# EAGLE design attiny85 (EAGLE 7.7.0)
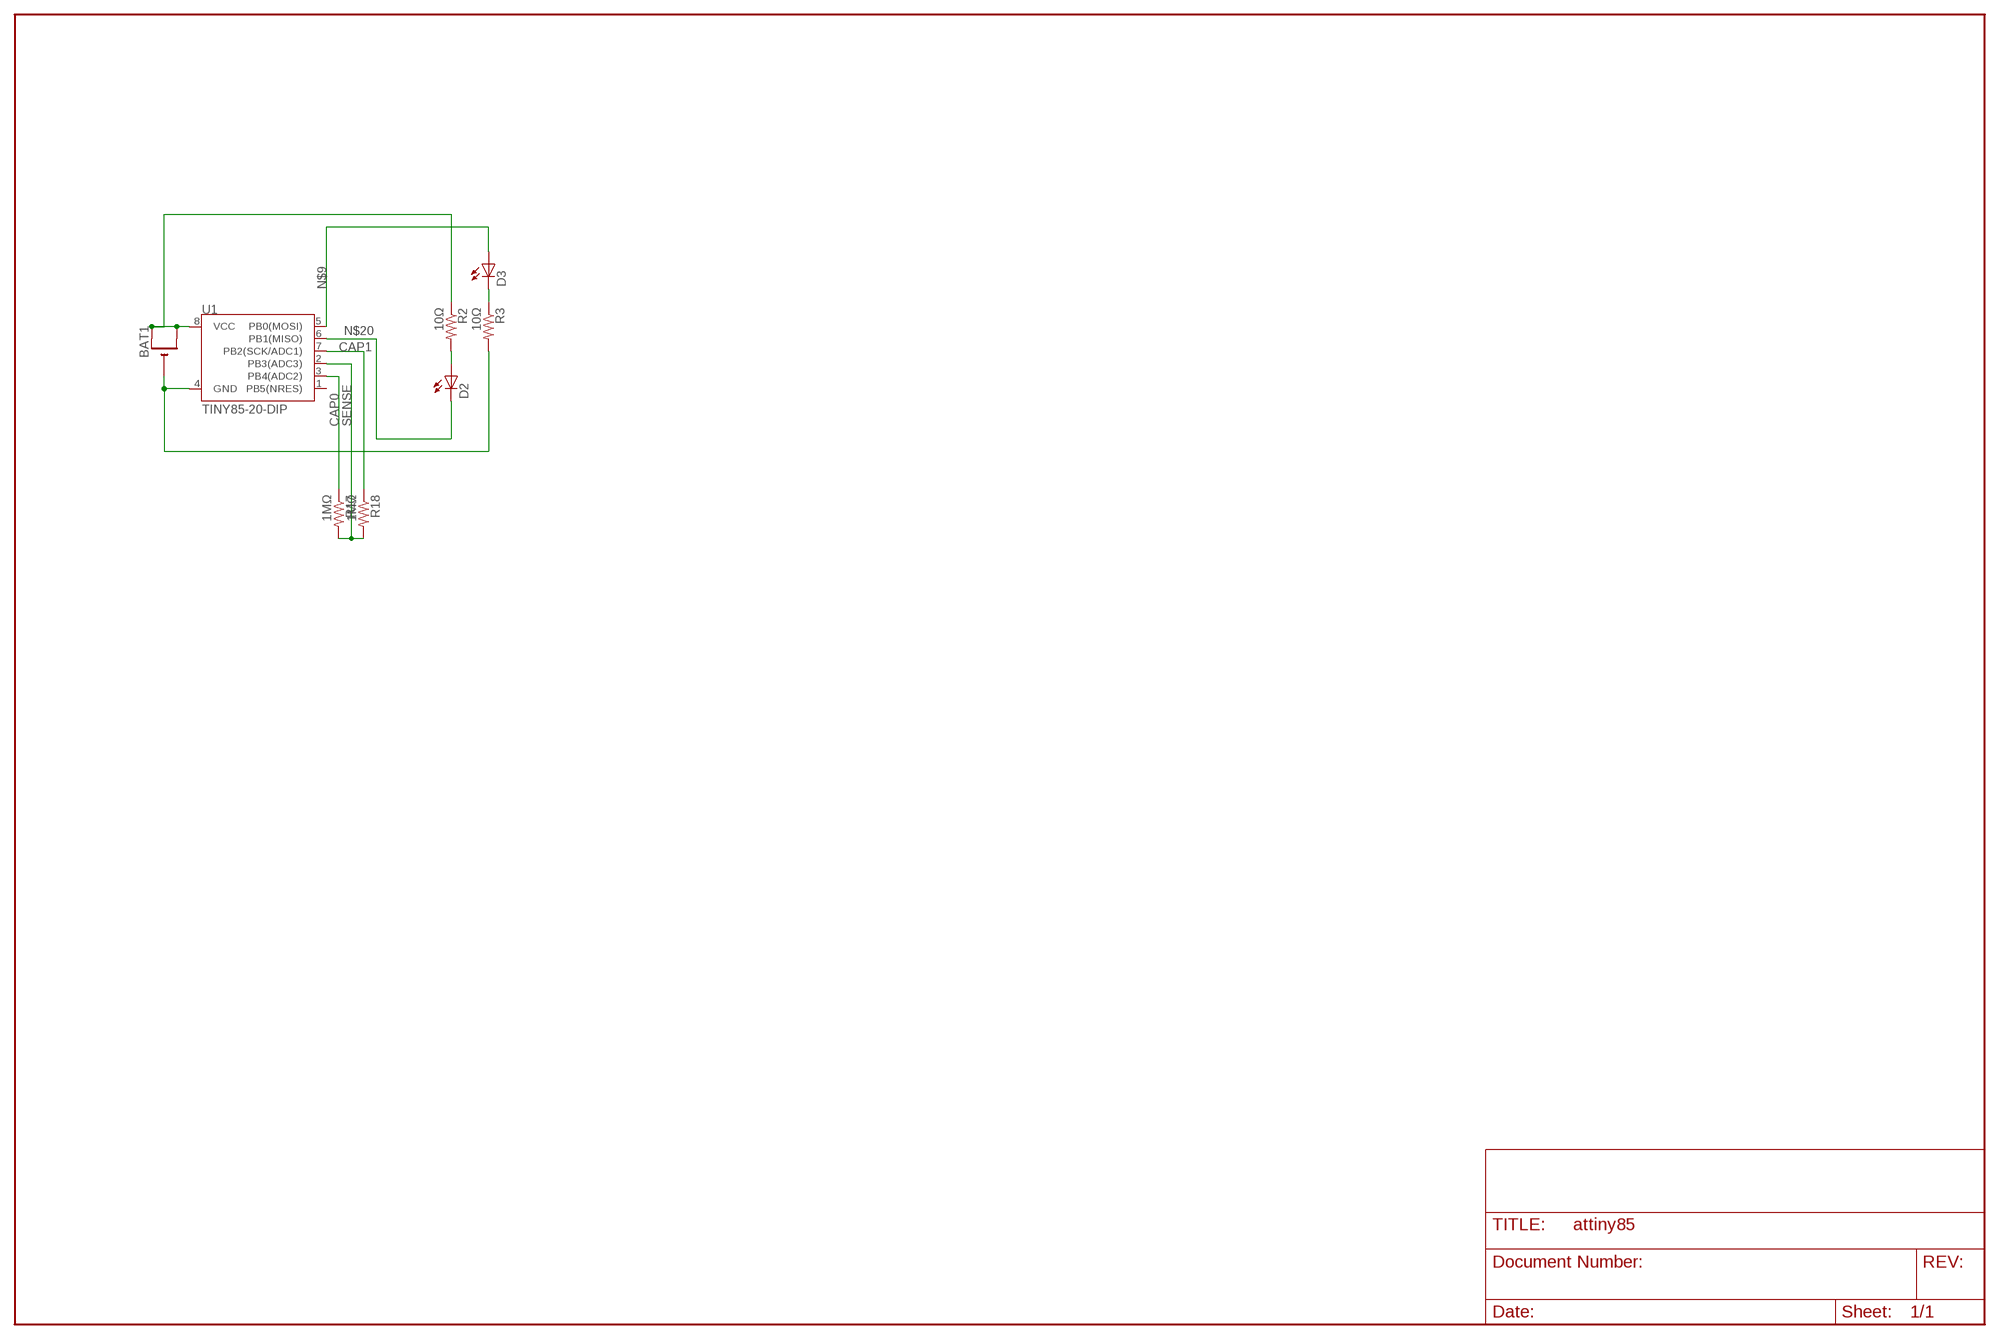
[diagram p0: schematic, sheet 1]

## Parts
BAT1  CR2032THM  [CR2032-THRU]
D2  LED5MM  [LED5MM]
D3  LED5MM  [LED5MM]
R2  10Ω  1KOHM-1/4W-5%(PTH)  [AXIAL-0.3]
R3  10Ω  1KOHM-1/4W-5%(PTH)  [AXIAL-0.3]
R17  1MΩ  1KOHM-1/4W-5%(PTH)  [AXIAL-0.3]
R18  1MΩ  1KOHM-1/4W-5%(PTH)  [AXIAL-0.3]
U1  TINY85-20-DIP  ATTINY45TINY85-20-DIP  [DIP08]

## Nets
CAP0: R17.P$1 U1.3(PB4(ADC2))
CAP1: R18.P$1 U1.7(PB2(SCK/ADC1))
GND: BAT1.- R3.P$2 U1.4(GND)
N$2: D2.A R2.P$2
N$3: D3.K(C) R3.P$1
N$9: D3.A U1.5(PB0(MOSI))
N$20: D2.K(C) U1.6(PB1(MISO))
SENSE: R17.P$2 R18.P$2 U1.2(PB3(ADC3))
VCC: BAT1.+1(+) BAT1.+2(+1) R2.P$1 U1.8(VCC)
Unconnected: U1.1(PB5(NRES))

## Library data of the parts
BAT1 = adafruit-john modded:CR2032
D2 D3 = LED:LED: LED OSRAM: - CHIPLED LG R971, LG N971, LY N971, LG Q971, LY Q971, LO R971, LY R971 LH N974, LH R974 LS Q976, LO Q976, LY Q976 LO Q996 - Hyper CHIPLED LW Q18S LB Q993, LB Q99A, LB R99A - SideLED LS A670, LO A670, LY A670, LG A670, LP A670 LB A673, LV A673, LT A673, LW A673 LH A674 LY A675 LS A676, LA A676, LO A676, LY A676, LW A676 LS A679, LY A679, LG A679 - Hyper Micro SIDELED® LS Y876, LA Y876, LO Y876, LY Y876 LT Y87S - SmartLED LW L88C, LW L88S LB L89C, LB L89S, LG L890 LS L89K, LO L89K, LY L89K LS L896, LA L896, LO L896, LY L896 - TOPLED LS T670, LO T670, LY T670, LG T670, LP T670 LSG T670, LSP T670, LSY T670, LOP T670, LYG T670 LG T671, LOG T671, LSG T671 LB T673, LV T673, LT T673, LW T673 LH T674 LS T676, LA T676, LO T676, LY T676, LB T676, LH T676, LSB T676, LW T676 LB T67C, LV T67C, LT T67C, LS T67K, LO T67K, LY T67K, LW E67C LS E67B, LA E67B, LO E67B, LY E67B, LB E67C, LV E67C, LT E67C LW T67C LS T679, LY T679, LG T679 LS T770, LO T770, LY T770, LG T770, LP T770 LB T773, LV T773, LT T773, LW T773 LH T774 LS E675, LA E675, LY E675, LS T675 LS T776, LA T776, LO T776, LY T776, LB T776 LHGB T686 LT T68C, LB T68C - Hyper Mini TOPLED® LB M676 - Mini TOPLED Santana® LG M470 LS M47K, LO M47K, LY M47K Source: http://www.osram.convergy.de LUXEON: - LUMILED® LXK2-PW12-R00, LXK2-PW12-S00, LXK2-PW14-U00, LXK2-PW14-V00 LXK2-PM12-R00, LXK2-PM12-S00, LXK2-PM14-U00 LXK2-PE12-Q00, LXK2-PE12-R00, LXK2-PE12-S00, LXK2-PE14-T00, LXK2-PE14-U00 LXK2-PB12-K00, LXK2-PB12-L00, LXK2-PB12-M00, LXK2-PB14-N00, LXK2-PB14-P00, LXK2-PB14-Q00 LXK2-PR12-L00, LXK2-PR12-M00, LXK2-PR14-Q00, LXK2-PR14-R00 LXK2-PD12-Q00, LXK2-PD12-R00, LXK2-PD12-S00 LXK2-PH12-R00, LXK2-PH12-S00 LXK2-PL12-P00, LXK2-PL12-Q00, LXK2-PL12-R00 Source: www.luxeon.com KINGBRIGHT: KA-3528ASYC Source: www.kingbright.com
R2 R3 R17 R18 = SparkFun-Resistors:1KOHM-1/4W-5%(PTH): RES-08380; PROD_ID: RES-08380; VALUE: 1k
U1 = SparkFun-DigitalIC:ATTINY45: Atmel 8-pin 2/4/8kB flash uC; PROD_ID: IC-09445

## Board
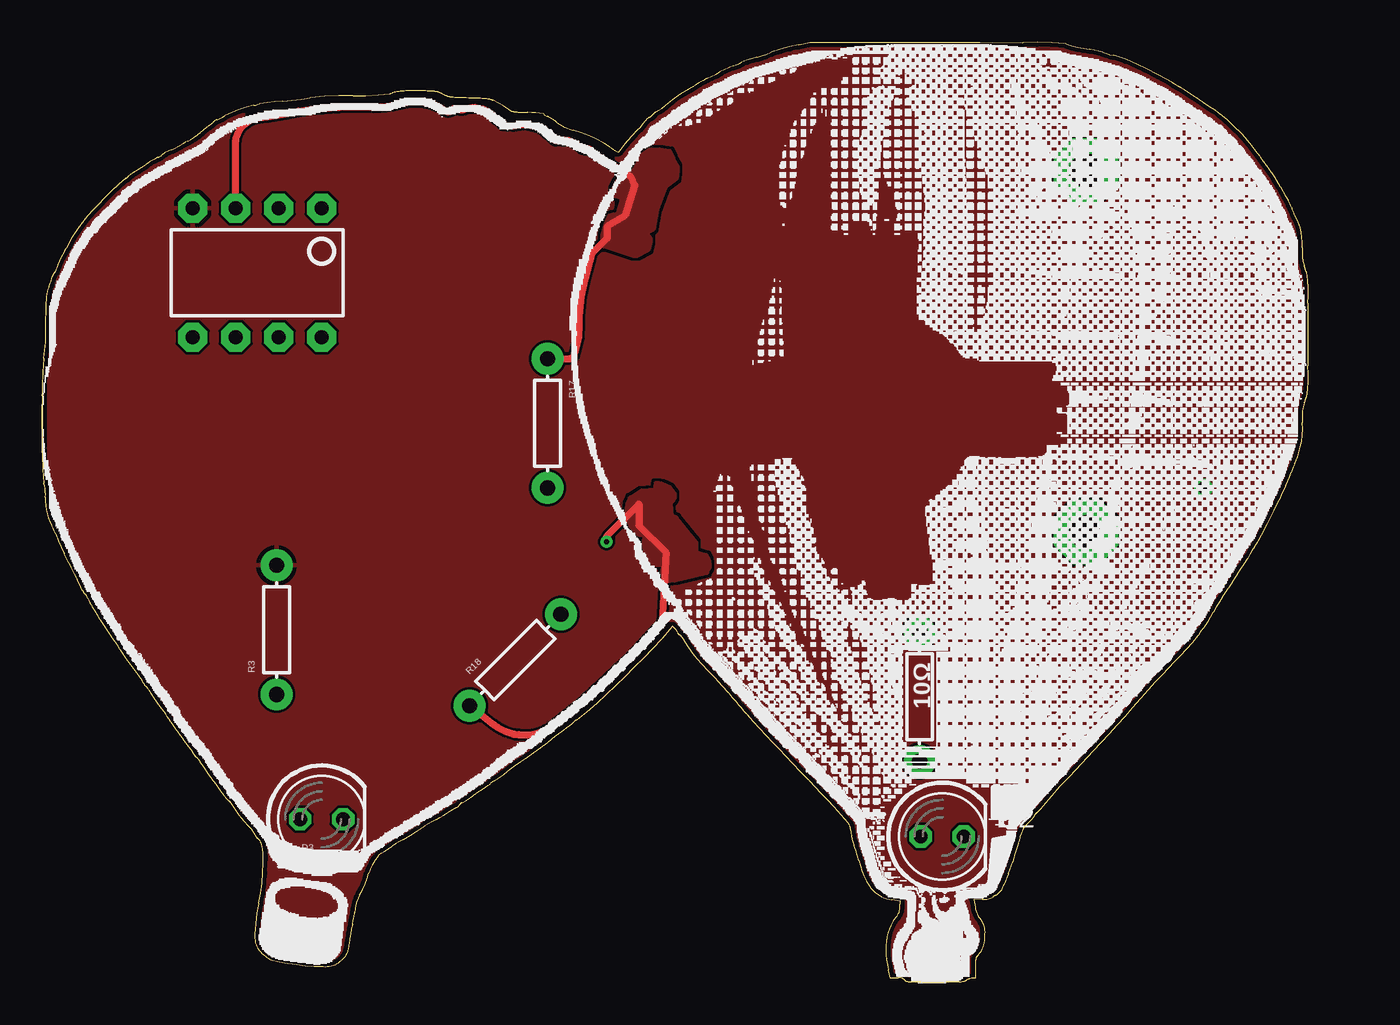
[diagram p1: board, top side]
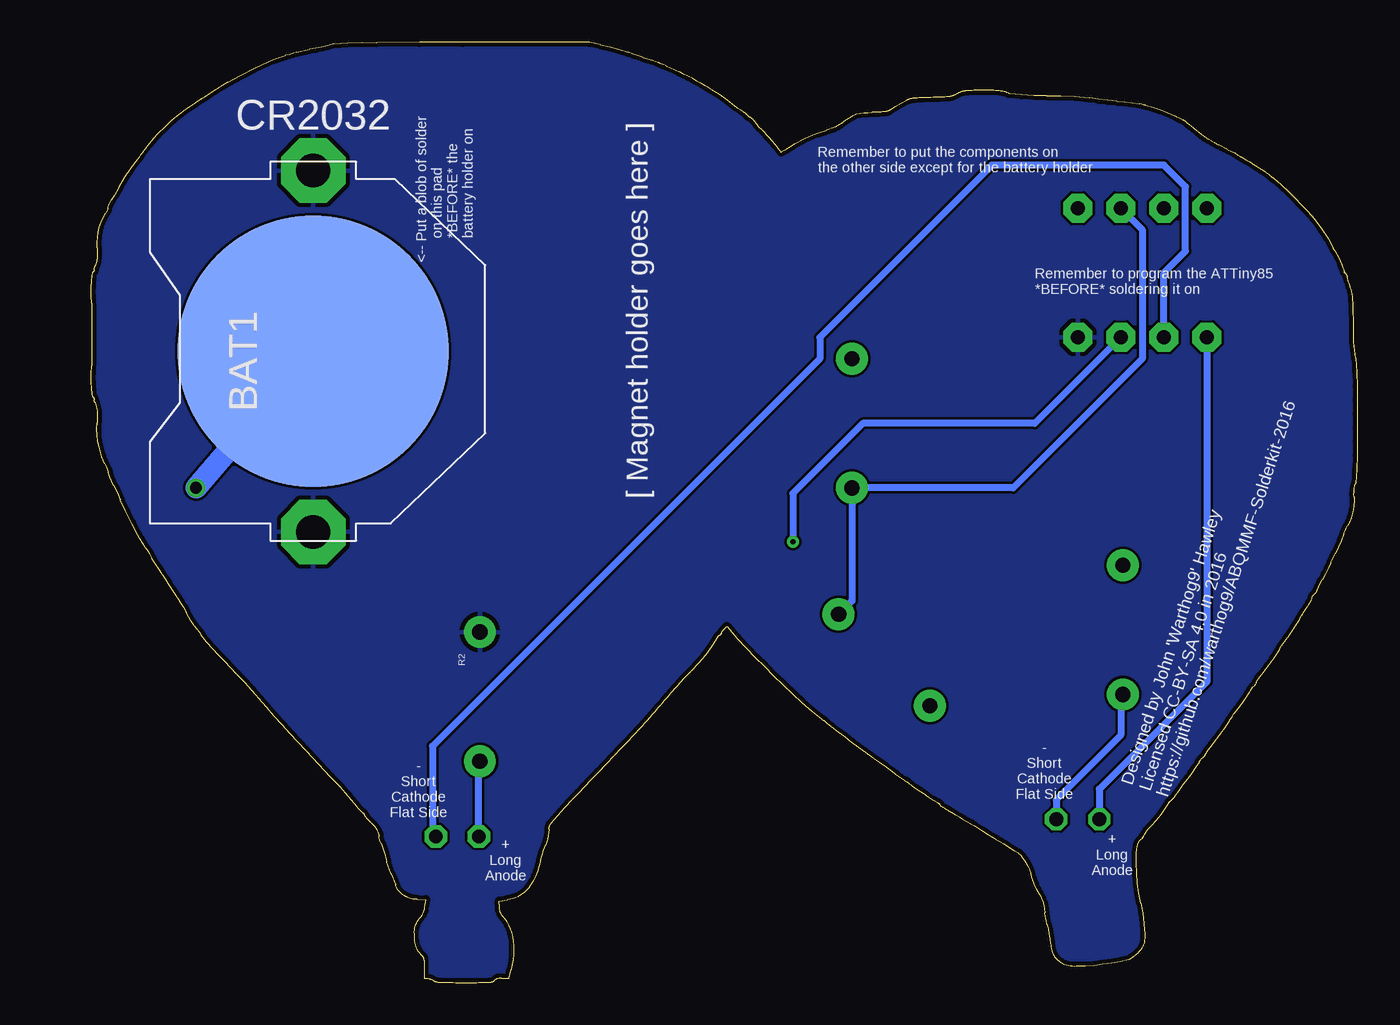
[diagram p2: board, bottom side, seen from below]

Size 74.75 x 55.5 mm. Coordinates in mm from the lower left corner, seen from the top.
Outline: 50.94,0.12 arc69 50.48,0.25 50.09,0.25 49.96,0.76 arc-16 49.83,1.95 arc-41 50.38,3.81 arc46 50.65,4.47 50.66,4.81 50.18,4.89 arc-50 48.83,5.7 arc-19 48.22,7.19 arc6 47.93,8.09 arc-20 47.72,9.05 arc32 47.6,9.4 arc3 46.35,10.8 arc0 45.27,11.94 arc1 43.87,13.4 arc-1 42.72,14.6 arc-2 41.61,15.82 arc1 41.11,16.41 arc0 40.54,17.06 arc2 39.33,18.39 arc-15 37.78,20.37 arc40 37.64,20.51 arc-61 37.54,20.62 arc27 37.38,20.85 37.22,21.02 36.58,20.3 arc-3 34.98,18.63 arc-2 33.32,17.02 arc-9 31.57,15.52 arc23 31.4,15.38 arc-11 31.05,15.1 arc2 29.86,14.19 arc-3 28.56,13.24 arc3 27.48,12.46 arc-7 26.69,11.91 arc23 26.47,11.76 arc-13 26.28,11.6 arc4 25.59,11.13 arc-6 24.78,10.6 arc51 24.64,10.49 arc-32 24.37,10.29 arc8 23.92,10.02 arc-6 23.24,9.62 arc4 22.59,9.24 arc-6 21.3,8.44 arc8 20.65,8.03 arc-8 19.99,7.63 arc22 19.48,6.92 arc17 19.28,6.45 arc-14 18.74,5.18 arc22 18.43,4.13 arc-9 18.31,3.44 arc7 18.15,2.58 18.14,2.48 18.13,2.39 18.11,2.3 18.1,2.22 18.09,2.15 18.07,2.08 18.06,2.01 18.05,1.95 18.03,1.9 18.02,1.85 18,1.8 17.99,1.75 17.97,1.71 17.95,1.67 17.93,1.63 17.91,1.6 17.89,1.56 17.87,1.53 17.84,1.49 17.81,1.46 17.78,1.43 17.75,1.39 17.71,1.36 17.68,1.32 arc-48 16.57,0.95 arc-8 15.01,1.06 arc-11 13.47,1.35 arc-15 12.96,1.74 arc-54 12.54,2.85 arc-10 12.78,4.68 arc13 13.03,7.07 arc25 12.91,8.24 arc34 12.73,8.5 arc-88 12.66,8.58 arc12 12.16,9.24 arc-12 11.11,10.61 arc62 11.02,10.71 arc-22 10.76,11 arc2 10.01,12.03 arc-6 9.33,13.01 arc29 9.12,13.28 arc-48 9,13.41 arc7 8.33,14.35 arc-4 7.58,15.39 arc7 7.27,15.85 arc-6 6.27,17.29 arc25 6.12,17.49 arc-30 5.96,17.7 arc13 5.63,18.2 arc-5 4.6,19.64 arc5 4.1,20.39 arc-4 3.43,21.42 arc3 2.96,22.18 arc-14 2.67,22.68 arc28 2.52,22.93 arc-27 2.36,23.17 arc10 2.07,23.76 arc-5 1.55,24.78 arc8 1.3,25.31 arc-7 0.78,26.48 arc7 0.56,26.99 arc-32 0.18,28.64 arc22 0.08,29.48 arc-6 0,31.93 arc-1 0,34.39 arc-6 0.08,36.84 arc12 0.2,38.73 0.2,38.93 0.21,39.11 0.21,39.28 0.22,39.44 0.22,39.58 0.22,39.72 0.23,39.84 0.23,39.95 0.24,40.06 0.24,40.15 0.25,40.24 0.25,40.32 0.26,40.39 0.27,40.46 0.27,40.52 0.28,40.58 0.29,40.64 0.3,40.69 0.31,40.74 0.32,40.79 0.33,40.84 0.35,40.88 0.36,40.93 0.37,40.98 arc1 0.58,41.64 arc-35 0.7,41.88 arc82 0.75,41.96 arc-10 1.31,43.18 arc26 1.4,43.35 arc-8 2.53,45.09 arc-5 3.68,46.32 arc-8 4.91,47.46 arc37 5.08,47.58 arc-16 5.38,47.81 arc3 6.11,48.28 arc-8 6.81,48.7 arc23 7.05,48.84 arc-11 7.64,49.17 arc6 8.2,49.45 arc-9 8.57,49.64 arc13 9.36,50.18 arc-6 9.83,50.56 arc13 10.06,50.75 arc-25 10.33,50.94 arc14 10.76,51.15 arc-15 12.48,51.77 arc12 12.82,51.87 arc-7 14.18,52.02 arc6 15.83,52.21 arc-10 18.35,52.35 arc9 20.55,52.46 20.57,52.48 20.6,52.5 20.64,52.52 20.68,52.53 20.72,52.55 20.77,52.56 20.82,52.58 20.87,52.59 20.93,52.6 21,52.61 21.06,52.62 21.14,52.63 21.21,52.64 21.29,52.65 21.38,52.65 21.46,52.66 21.56,52.66 21.65,52.66 21.75,52.67 21.86,52.67 21.97,52.67 22.08,52.67 22.2,52.66 22.32,52.66 22.43,52.66 22.54,52.66 22.64,52.65 22.73,52.65 22.81,52.65 22.88,52.64 22.95,52.64 23.01,52.64 23.07,52.63 23.12,52.63 23.17,52.62 23.22,52.62 23.26,52.61 23.3,52.6 23.33,52.59 23.37,52.58 23.4,52.57 23.43,52.56 23.47,52.54 23.5,52.53 23.53,52.51 23.57,52.49 23.61,52.47 23.65,52.45 23.69,52.43 23.72,52.41 23.76,52.39 23.79,52.38 23.83,52.36 23.86,52.35 23.89,52.33 23.93,52.32 23.97,52.31 24.01,52.3 24.05,52.3 24.09,52.29 24.14,52.28 24.2,52.28 24.26,52.27 24.33,52.27 24.4,52.26 24.48,52.26 24.57,52.26 24.67,52.25 24.78,52.25 24.9,52.24 25.02,52.24 25.16,52.24 25.29,52.23 25.41,52.23 25.52,52.23 25.62,52.22 25.71,52.22 25.8,52.22 25.88,52.21 25.95,52.21 26.02,52.2 26.08,52.2 26.14,52.19 26.19,52.19 26.24,52.18 26.29,52.18 26.33,52.17 26.37,52.16 26.4,52.15 26.44,52.14 26.47,52.13 26.5,52.12 26.53,52.11 26.56,52.1 26.59,52.08 26.62,52.07 arc-11 27.57,51.52 27.59,51.5 27.6,51.49 27.62,51.48 27.64,51.47 27.66,51.46 27.68,51.45 27.71,51.44 27.73,51.43 27.76,51.42 27.79,51.42 27.82,51.41 27.86,51.4 27.9,51.4 27.94,51.39 27.99,51.39 28.04,51.38 28.1,51.38 28.16,51.38 28.22,51.37 28.29,51.37 28.37,51.37 28.46,51.36 28.55,51.36 28.64,51.36 arc-13 29.59,51.27 arc21 29.85,51.12 arc-13 30.4,50.76 arc27 31.34,50.31 arc-19 33.59,49.27 arc14 34.02,49.02 arc-6 35.16,50.35 arc10 35.58,50.83 arc-31 35.84,51.06 arc32 36.06,51.24 arc-40 36.2,51.37 arc10 36.76,51.76 arc-9 38.14,52.73 arc12 38.53,52.96 arc-6 39.25,53.36 arc1 40.02,53.76 arc-6 40.8,54.1 arc7 41.29,54.32 arc-7 42.19,54.63 arc7 43.03,54.91 arc-9 44.68,55.35 45.33,55.49 52.84,55.49 55.37,55.49 57.91,55.48 arc-5 60.44,55.43 arc16 61.86,55.09 arc-8 62.64,54.91 arc9 63.26,54.72 arc-8 64.31,54.35 arc-4 66.7,53.14 arc7 67.13,52.88 arc-4 68.3,52.12 arc5 69.17,51.56 arc-9 70.33,50.58 arc-12 71.78,48.93 arc11 72,48.61 arc-9 73.1,46.98 arc2 73.56,46.16 arc-17 73.77,45.72 arc21 73.91,45.41 arc-35 74.39,43.38 arc18 74.5,42.3 arc-38 74.58,42.09 arc61 74.66,41.92 arc-12 74.73,40.09 74.73,38.25 74.73,36.41 arc-12 74.66,34.57 arc61 74.58,34.4 arc-60 74.5,34.23 arc21 74.41,33.03 arc-23 74.19,31.27 arc-8 73.95,30.61 arc9 73.75,30.11 arc-6 73.41,29.31 arc2 73.04,28.51 arc-4 72,26.43 arc-5 71.56,25.68 arc4 71.18,25.05 arc-4 70.57,24.09 arc3 70.03,23.26 arc-6 69.68,22.74 arc7 69.15,21.87 arc-8 68.66,21.06 arc4 68.25,20.5 arc-8 67.23,19.33 arc-1 66.15,18.21 arc4 64.85,16.78 arc-3 63.48,15.21 arc-1 62.06,13.68 60.64,12.16 arc6 59.07,10.4 arc-17 58.72,10.03 arc62 58.63,9.92 arc-16 58.24,9.43 arc43 57.77,8.65 arc-13 57.64,8.22 arc10 57.3,7.13 arc-7 57.05,6.42 arc2 56.77,5.77 arc-49 56.3,5.15 arc35 56.12,5.04 arc-35 55.51,4.91 55,4.89 55.09,4.44 arc32 55.38,3.77 arc-49 55.66,2.76 arc-44 55.28,1.64 55.26,1.62 55.24,1.6 55.22,1.58 55.21,1.56 55.19,1.55 55.18,1.53 55.17,1.51 55.15,1.49 55.15,1.47 55.14,1.45 55.13,1.43 55.12,1.41 55.12,1.38 55.11,1.35 55.11,1.32 55.11,1.29 55.1,1.25 55.1,1.21 55.1,1.16 55.1,1.11 55.1,1.05 55.1,0.99 55.1,0.93 55.1,0.86 55.1,0.25 54.91,0.25 arc32 54.56,0.12 54.54,0.11 54.52,0.1 54.5,0.08 54.48,0.07 54.46,0.06 54.43,0.05 54.4,0.05 54.37,0.04 54.33,0.03 54.28,0.03 54.23,0.02 54.17,0.02 54.11,0.01 54.04,0.01 53.95,0.01 53.86,0.01 53.76,0 53.65,0 53.52,0 53.39,0 53.24,0 53.07,0 52.9,0 52.7,0 52.51,0 52.33,0 52.16,0 52.01,0 51.87,0 51.75,0 51.64,0 51.54,0.01 51.45,0.01 51.37,0.01 51.3,0.01 51.23,0.02 51.18,0.02 51.14,0.03 51.1,0.03 51.06,0.04 51.04,0.05 51.01,0.05 51,0.06 50.98,0.07 50.97,0.08 50.96,0.1 50.95,0.11 50.94,0.12
Outline: 50.94,0.12 50.94,0.12
Copper layers (1*16): Top 0.035mm / dielectric 1.5mm / Bottom 0.035mm
Design rules "default *": minimum track width 6mil, minimum drill 12mil, track to track 6mil, track to pad 6mil, pad to pad 6mil, via to via 6mil, smd to smd 6mil, copper to edge 10mil, drill to drill 8mil, minimum pad ring 10mil, minimum via ring 8mil, stop-mask expansion 4mil, vias tented up to drill 0mil, thermal gap 10mil

### Footprints (pad centres in the part's own frame; a part is rotated, then mirrored left to right if it is on the bottom)
CR2032-THRU = drill 2 pad 3.81 octagon: +1 -10.668,0; +2 10.668,0 | smd 16.002 x 16.002: - 0,0
LED5MM = drill 0.813 octagon: A -1.27,0; K 1.27,0
AXIAL-0.3 = drill 0.9 pad 1.88: P$1 -3.81,0; P$2 3.81,0
DIP08 = drill 0.813 pad 1.727 octagon: 1 -3.81,-3.81; 2 -1.27,-3.81; 3 1.27,-3.81; 4 3.81,-3.81; 5 3.81,3.81; 6 1.27,3.81; 7 -1.27,3.81; 8 -3.81,3.81

### Placement (x,y rotation side)
BAT1  61.64,37.26 90 bottom
D2  53.14,8.62 0 top
D3  16.5,9.64 0 top
R2  51.8,16.88 270 top
R3  13.83,20.81 90 top
R17  29.83,33.01 270 top
R18  27.93,19.04 45 top
U1  12.69,41.9 180 top

### Tracks (layer width: path | path; a pad name or v marks a point on that pad's centre or on a via)
CAP0
  Top 0.406: U1.3 11.42,49.52 arc-84 12.78,51.04 arc6 14.37,51.29 arc-8 16.62,51.61 arc-6 19.54,51.68 arc17 21.1,51.87 arc-35 23.13,51.8 arc-17 23.73,51.48 arc86 24.27,51.55 arc-77 24.43,51.58 arc47 24.94,51.55 arc-76 26.78,50.95 27.23,50.6 27.8,50.56 28.18,50.63 28.53,50.66 28.97,50.56 29.32,50.47 29.64,50.25 30.08,49.9 arc79 30.43,49.71 arc-57 31.77,49.29 arc65 32.18,49.2 arc-106 32.37,49.07 34.72,47.58 34.97,47.07 34.4,45.26 33.35,44.63 33.35,43.93 32.43,43.01 32.05,41.58 31.8,40.5 31.7,39.36 31.7,38.75 31.67,38.12 31.42,37.13 arc-90 31.1,36.82 R17.P$1
  pour Top: 35.61,44.21 35.93,43.87 35.77,43.26 35.04,42.88 33.16,43.48 33.07,43.99 33.26,44.63 33.48,45.23 33.74,45.33 34.02,45.39 34.15,45.83 34.28,46.28 33.74,46.47 33.7,46.79 33.96,47.29 34.47,47.45 34.78,47.48 34.85,47.8 35.23,48.44 35.39,48.82 35.89,49.17 36.43,49.17 37.01,49.07 37.2,48.63 37.51,48.12 37.42,47.45 36.82,47.01 36.69,46.72 36.28,45.64 36.05,44.47
CAP1  (via drill 0.3)
  Top 0.406: v33.32,26.02 33.32,26.34 35.23,28.24 35.23,26.97 36.82,25.39 36.59,21.23 34.69,19.2 31.67,16.37 30.37,15.35 arc-80 26.66,15.23 R18.P$1
  Bottom 0.406: U1.7 19.04,33.01 29.2,33.01 33.32,28.88 v33.32,26.02
  pour Top: 36.18,29.07 35.39,29.01 34.72,28.59 34.56,28.21 34.47,27.45 34.75,26.94 35.23,26.47 35.55,26.43 35.51,25.96 35.58,25.36 35.77,25.07 36.09,24.66 36.5,24.69 36.75,24.78 36.59,24.24 36.85,23.7 37.36,23.77 39.23,24.21 39.42,24.56 39.32,24.97 39.2,25.2 38.75,25.32 38.59,25.2 38.59,25.96 37.42,27.42 37.16,27.51 37.13,27.99 37.07,28.31 37.2,28.43 37.39,28.75 37.07,29.17 36.53,29.42 36.24,29.48
GND  (via drill 0.7)
  Bottom 1.27: BAT1.- v68.57,29.2
  pour Top (rank 6): -3.82,-0.01 77.46,-0.01 77.46,57.14 -0.01,57.14
N$2
  Bottom 0.406: D2.A 51.87,13 R2.P$2
N$3
  Bottom 0.406: D3.K 17.83,9.7 | 17.77,10.15 D3.K | R3.P$1 13.96,16.88 13.96,14.59 17.77,10.78 D3.K
N$9
  Bottom 0.406: U1.5 8.88,17.77 15.23,11.42 D3.A
N$20
  Bottom 0.406: U1.6 11.42,41.9 10.15,43.17 10.15,46.98 11.42,48.25 21.58,48.25 31.74,38.09 31.74,36.82 54.6,13.96 54.6,8.81 D2.K
SENSE
  Bottom 0.406: R18.P$2 29.83,22.52 R17.P$2 20.31,29.2 12.69,36.82 12.69,44.44 U1.2
VCC
  pour Bottom: -3.82,-0.01 77.46,-0.01 77.46,57.14 -0.01,57.14

### Text on the board
bPlace: [ Magnet holder goes here ] | CR2032 | Remember to put the components on / the other side except for the battery holder | <-- Put a blob of solder / on this pad / *BEFORE* the / battery holder on | Remember to program the ATTiny85 / *BEFORE* soldering it on | - / Short / Cathode / Flat Side | Designed by John 'Warthog9' Hawley / Licensed CC-BY-SA 4.0 in 2016 / https://github.com/warthog9/ABQMMF-Solderkit-2016 | - / Short / Cathode / Flat Side | + / Long / Anode | + / Long / Anode